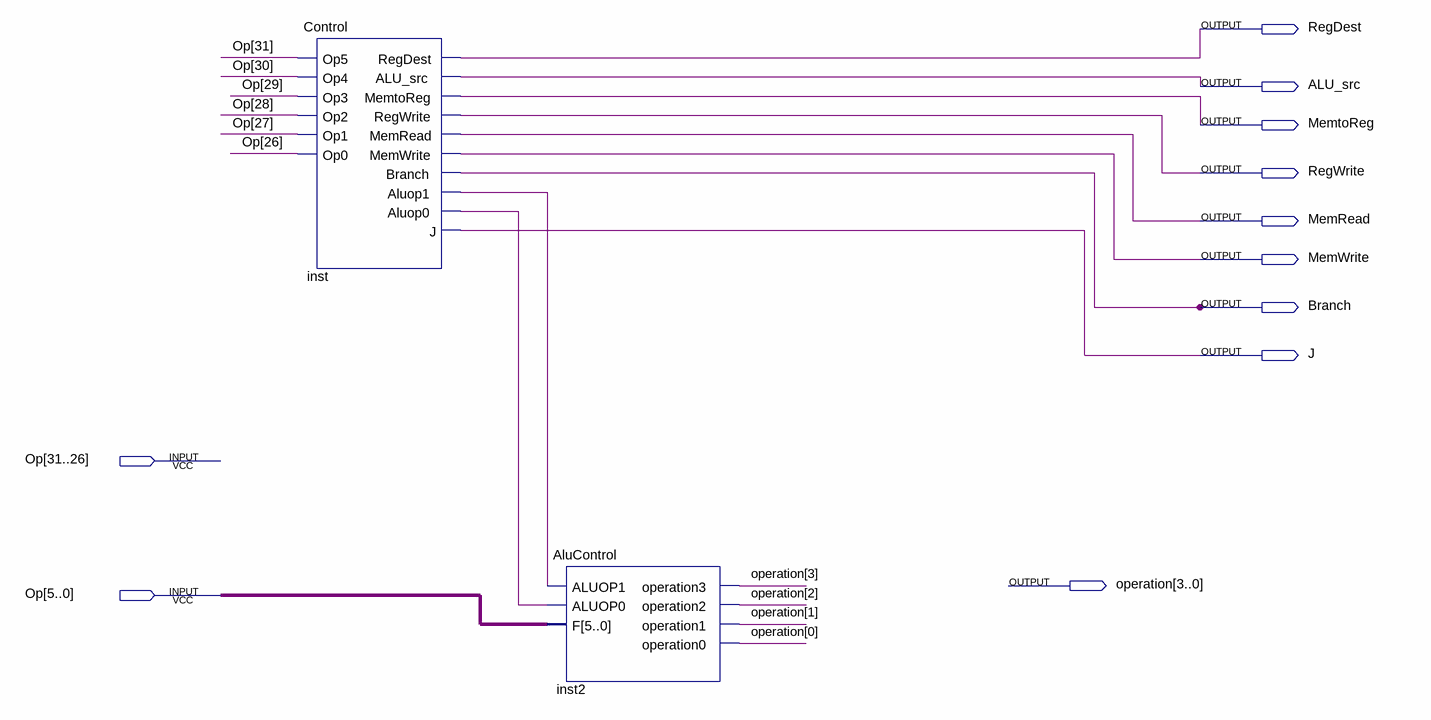
[diagram p0: schematic sheet]
// Quartus schematic AluC_Control.bdf as structural Verilog: 2 symbols, 11 pins
module AluC_Control (
  input  [31:0] Op,
  output RegDest,
  output ALU_src,
  output MemtoReg,
  output RegWrite,
  output MemRead,
  output MemWrite,
  output Branch,
  output J,
  output [3:0] operation
);

  wire inst_aluop0, inst_aluop1;

  Control inst (
    .Op5(Op[31]), .Op4(Op[30]), .Op3(Op[29]), .Op2(Op[28]), .Op1(Op[27]), .Op0(Op[26]), .RegDest(RegDest),
    .ALU_src(ALU_src), .MemtoReg(MemtoReg), .RegWrite(RegWrite), .MemRead(MemRead), .MemWrite(MemWrite),
    .Branch(Branch), .Aluop1(inst_aluop1), .Aluop0(inst_aluop0), .J(J));
  AluControl inst2 (
    .ALUOP1(inst_aluop1), .ALUOP0(inst_aluop0), .F(Op[5:0]), .operation3(operation[3]),
    .operation2(operation[2]), .operation1(operation[1]), .operation0(operation[0]));
endmodule
